# EasyEDA schematic SCH_USB-Hub-Reader_2024-05-11.json

## Sheets
1 Sheet_1: TITLE: USB HUB and Reader; REV: 1.0; Date: 2024-05-11; Sheet: 1/1; Drawn By: aaryavbehl47; Company: Your Company
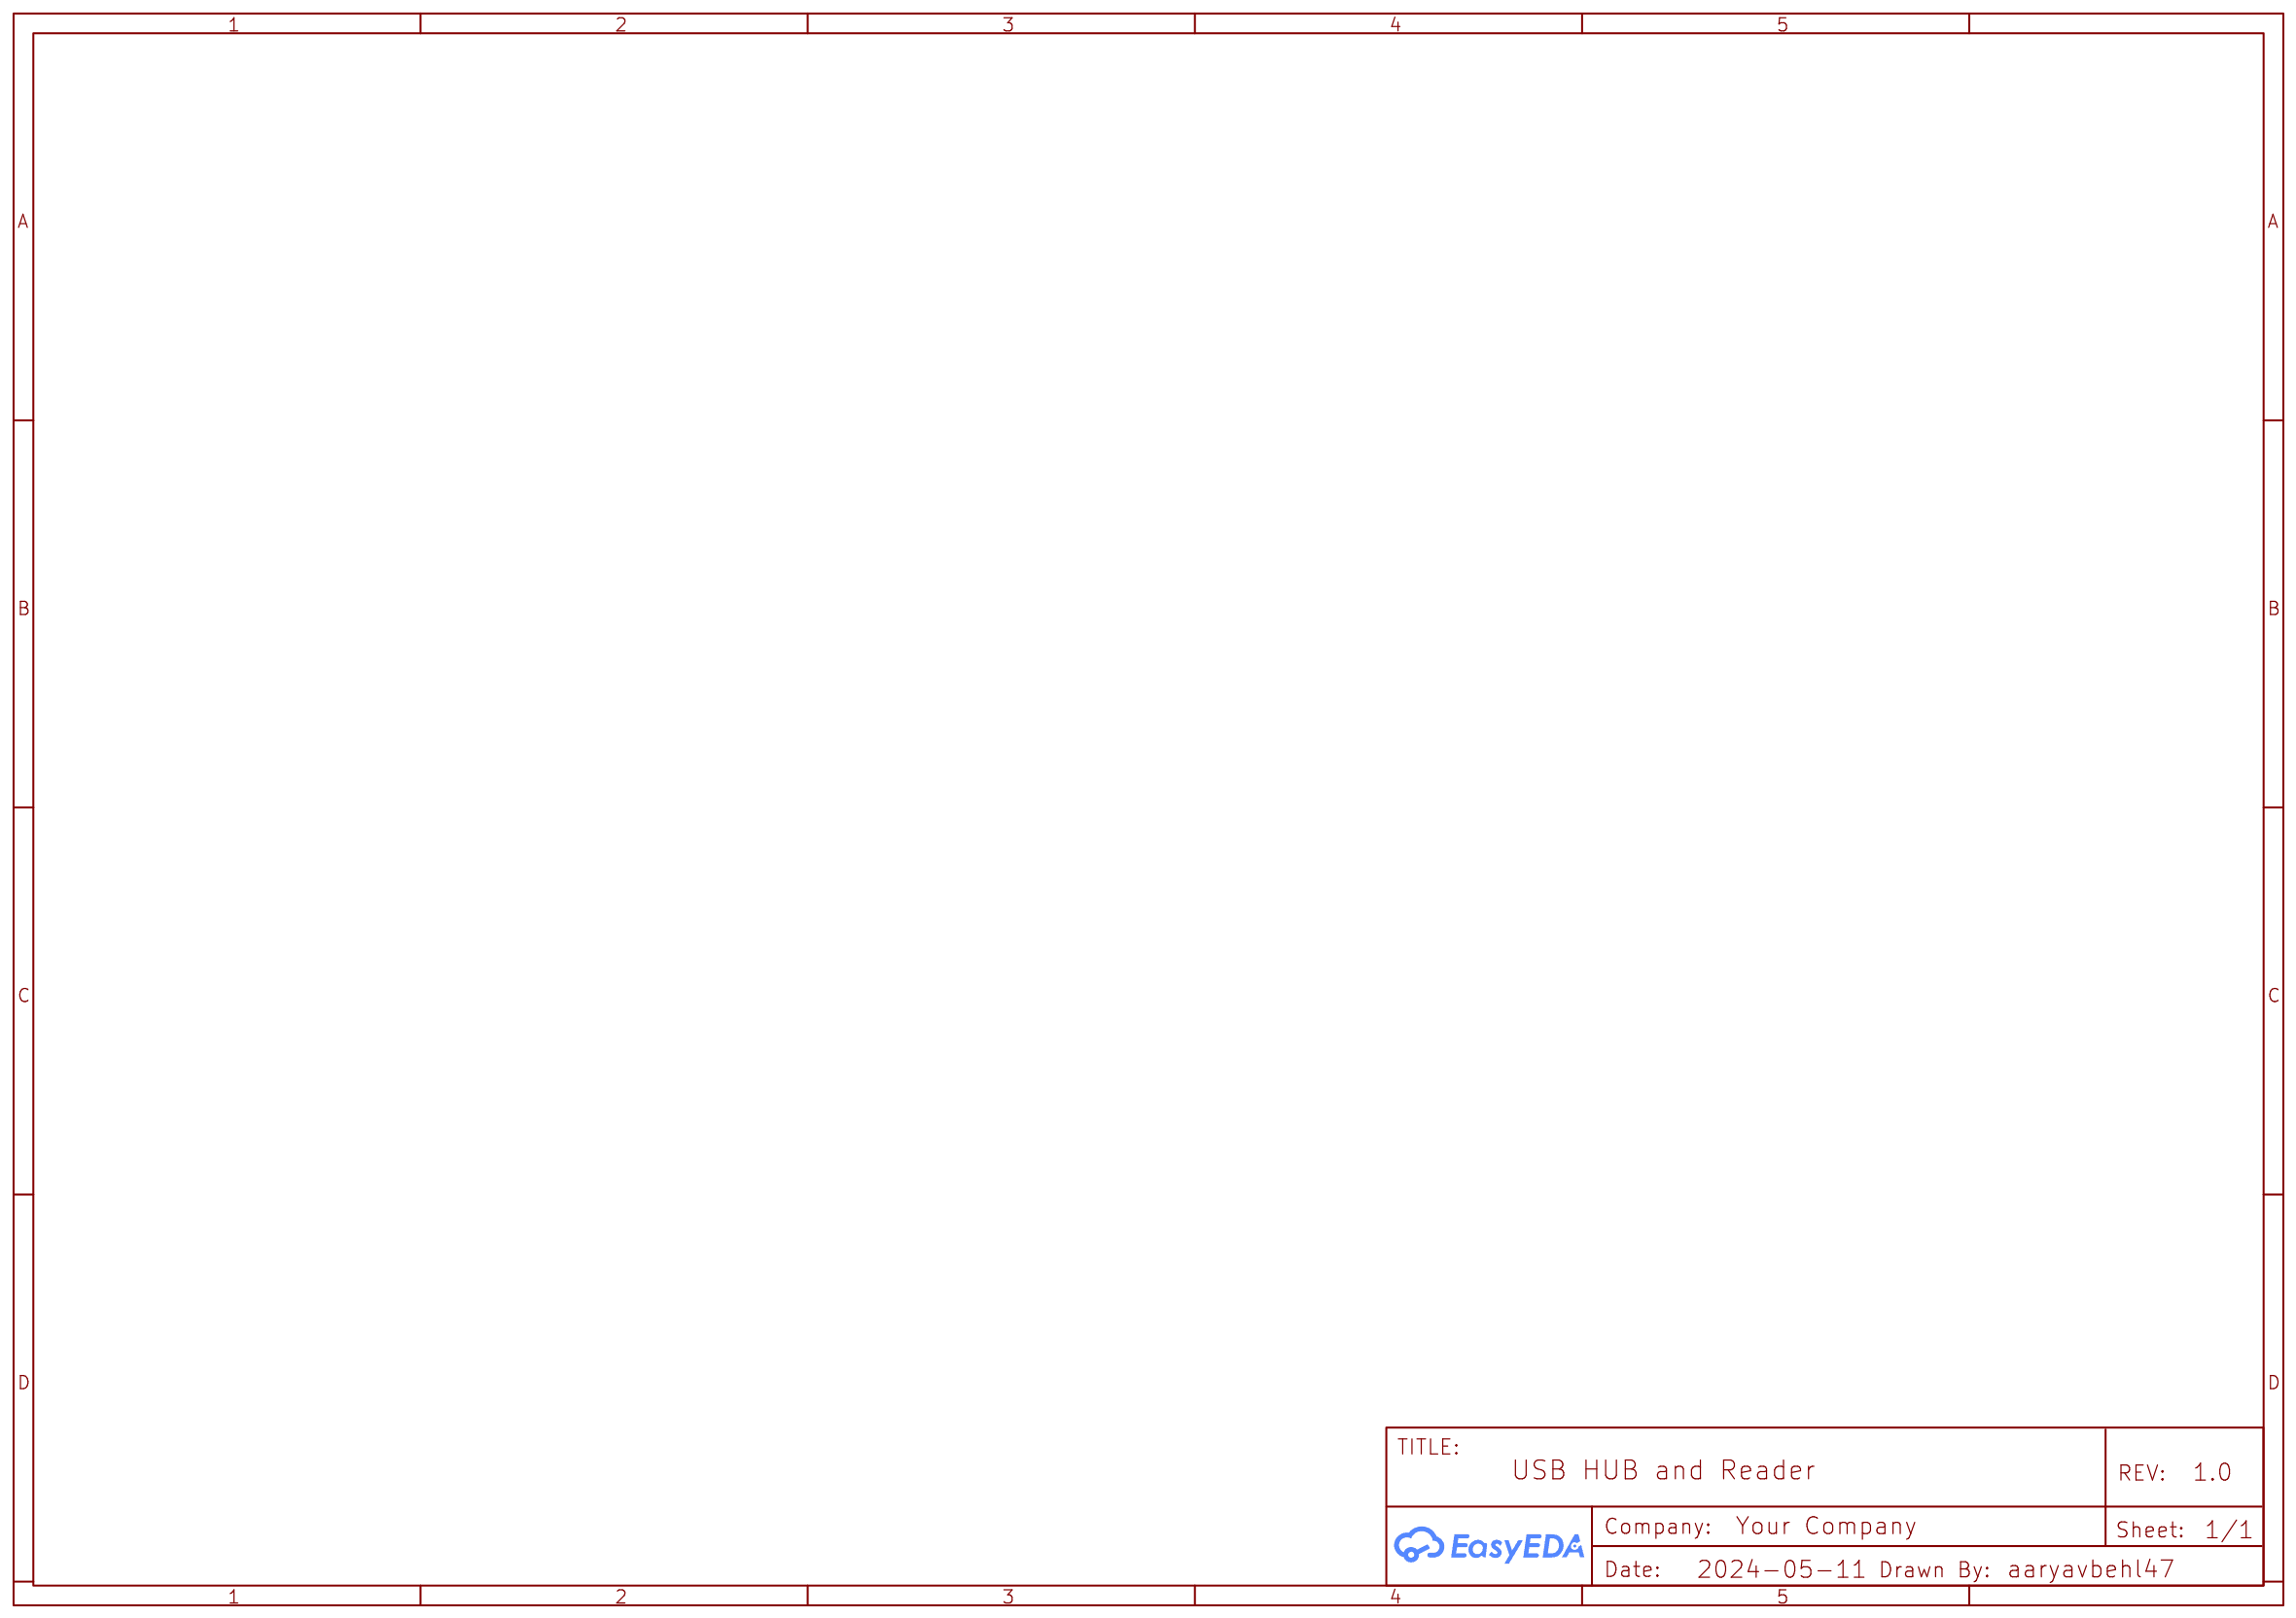
[diagram p0: Sheet_1]
2 hub schematics: TITLE: USB HUB & Reader; REV: 1; Date: 2024-04-20; Drawn By: bhargavsardana
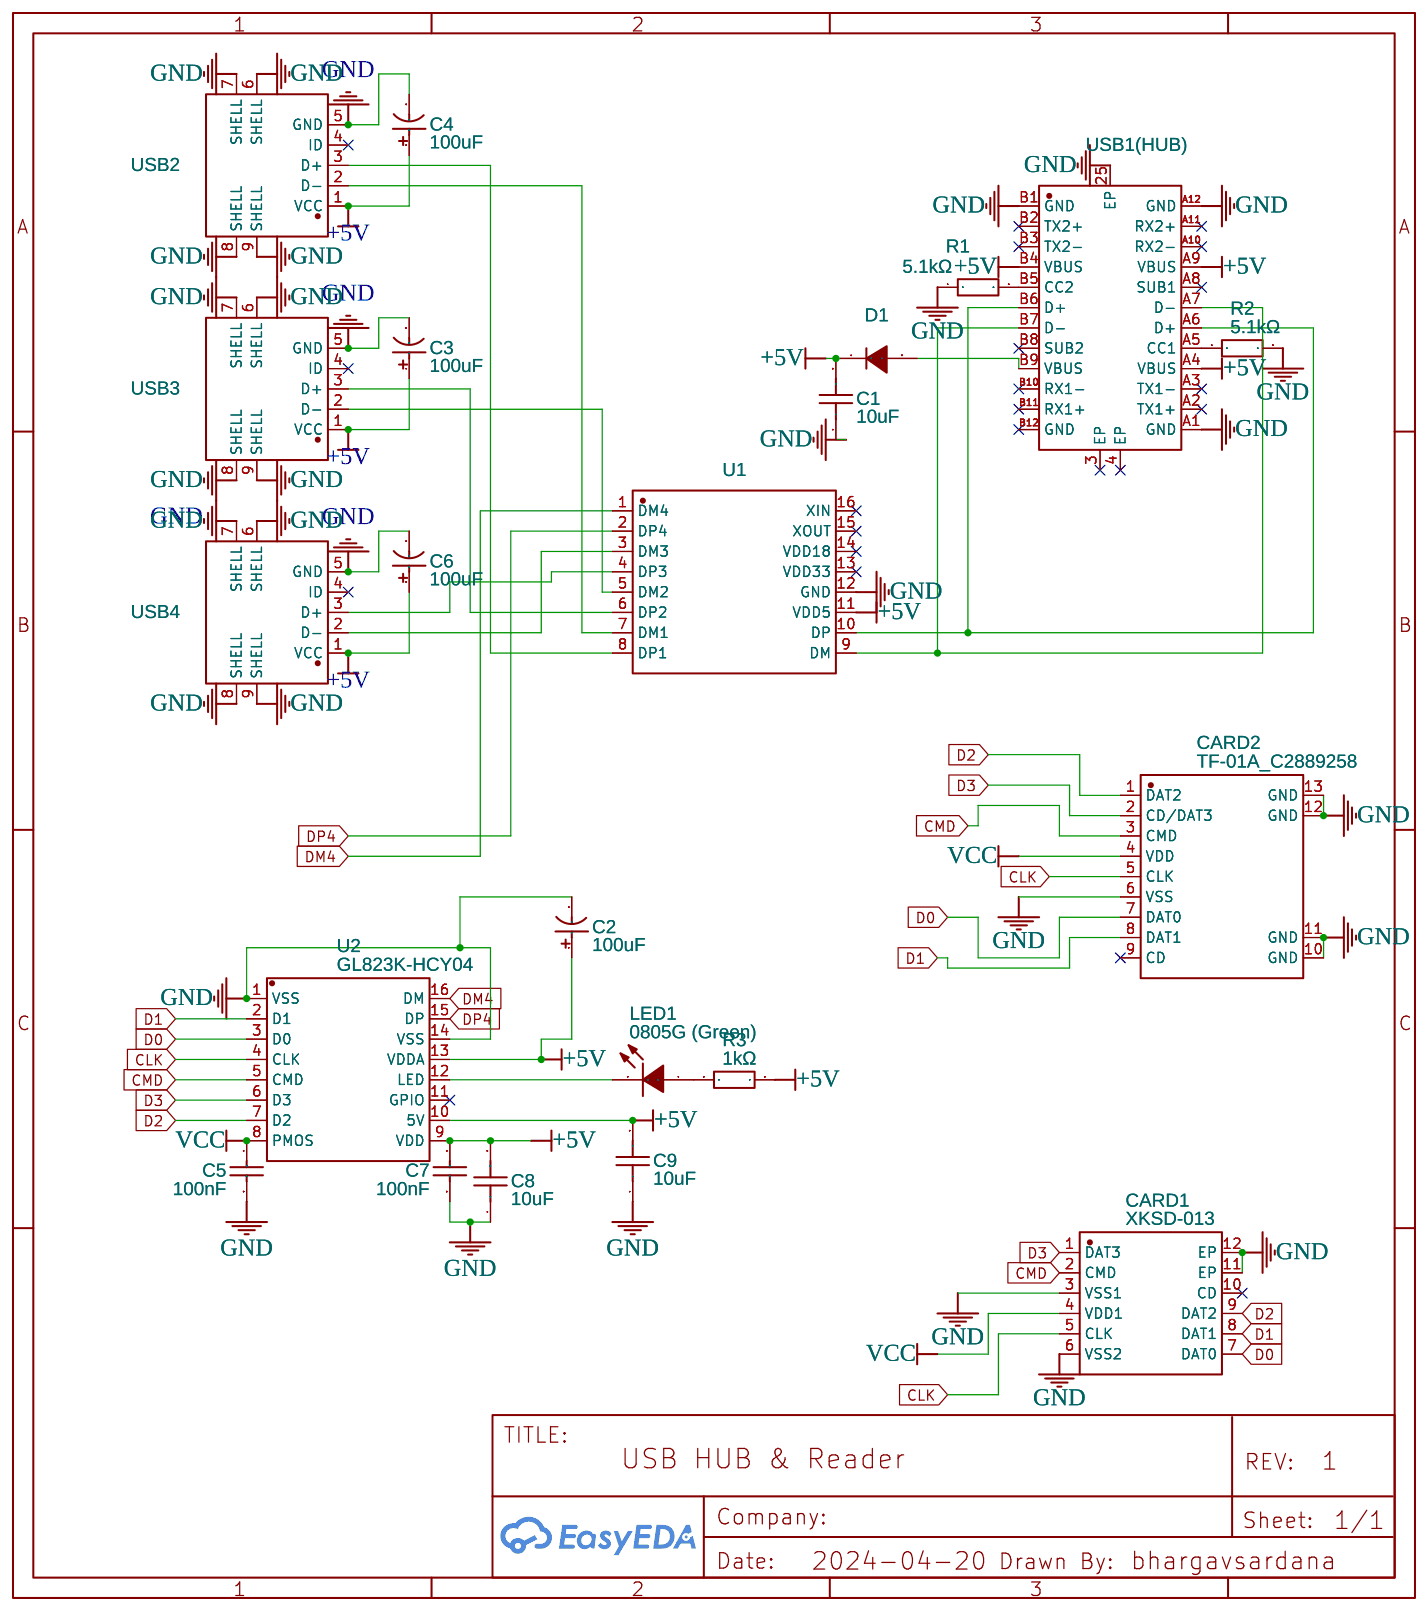
[diagram p1: hub schematics]

## Parts
C1  10uF  [C0603]
C2  100uF  [CAP-SMD_BD10.0-L10.3-W10.3-LS11.3-FD]
C3  100uF  [CAP-SMD_BD10.0-L10.3-W10.3-LS11.3-FD]
C4  100uF  [CAP-SMD_BD10.0-L10.3-W10.3-LS11.3-FD]
C5  100nF  [C0402]
C6  100uF  [CAP-SMD_BD10.0-L10.3-W10.3-LS11.3-FD]
C7  100nF  [C0402]
C8  10uF  [C0603]
C9  10uF  [C0603]
CARD1  XKSD-013  [SIM-SMD_XKSD-013]
CARD2  TF-01A_C2889258  [TF-SMD_TF-02]
D1  NSR0320MW2T1G  [SOD-323_L1.8-W1.3-LS2.5-RD]
LED1  0805G (Green)  [LED0805-R-RD]
R1  5.1kΩ  [R0402]
R2  5.1kΩ  [R0402]
R3  1kΩ  [R0402]
U1  SL2.1A  [SOP-16_L10.0-W3.9-P1.27-LS6.0-BL]
U2  GL823K-HCY04  [SSOP-16_L4.9-W3.9-P0.64-LS6.0-BL]
USB1(HUB)  TYPE-C 24P QT  [USB-C-SMD_TYPE-C-24P-QT]
USB2  U224-051N-3GRA035  [USB-A-TH_U224-051N-3GRA035]
USB3  U224-051N-3GRA035  [USB-A-TH_U224-051N-3GRA035]
USB4  U224-051N-3GRA035  [USB-A-TH_U224-051N-3GRA035]

## Library data of the parts
C1 C8 C9 = CL10A106KP8NNNC: Supplier: LCSC; Manufacturer: SAMSUNG(三星); Supplier Part: C19702; JLCPCB Part Class: Basic Part
C2-C4 C6 = RVT1J101M1010-C72481: Supplier: LCSC; Manufacturer: ROQANG(容强); Manufacturer Part: RVT1J101M1010; Supplier Part: C72481; JLCPCB Part Class: Extended Part
C5 C7 = CL05B104KO5NNNC: Supplier: LCSC; Manufacturer: SAMSUNG(三星); Supplier Part: C1525; JLCPCB Part Class: Basic Part
CARD1 = XKSD-013: Contributor: LCSC; Supplier: LCSC; Supplier Part: C2764609; Manufacturer: XKB Connectivity(中国星坤); JLCPCB Part Class: Extended Part
CARD2 = TF-01A_C2889258: Contributor: LCSC; Supplier: LCSC; Supplier Part: C2889258; Manufacturer: Yuandi(台湾元迪); Manufacturer Part: TF-01A; JLCPCB Part Class: Extended Part
D1 = NSR0320MW2T1G: Supplier: LCSC; Manufacturer: onsemi(安森美); Supplier Part: C48192; JLCPCB Part Class: Extended Part
LED1 = 0805G (Green): Supplier: LCSC; Manufacturer: KENTO; Manufacturer Part: KT-0805G; Supplier Part: C2297; JLCPCB Part Class: Basic Part
R1 R2 = 0402WGF5101TCE: Supplier: LCSC; Manufacturer: UNI-ROYAL(厚声); Supplier Part: C25905; JLCPCB Part Class: Basic Part
R3 = 0402WGF1001TCE: Supplier: LCSC; Manufacturer: UNI-ROYAL(厚声); Supplier Part: C11702; JLCPCB Part Class: Basic Part
U1 = SL2.1A: Contributor: LCSC; Supplier: LCSC; Supplier Part: C192893; Manufacturer: CoreChips(和芯润德); JLCPCB Part Class: Extended Part
U2 = GL823K-HCY04: Contributor: LCSC; Supplier: LCSC; Supplier Part: C284879; Manufacturer: GENESYS(创惟); JLCPCB Part Class: Extended Part
USB1(HUB) = TYPE-C 24P QT: Contributor: LCSC; Supplier: LCSC; Supplier Part: C2681555; Manufacturer: SHOU HAN(首韩)
USB2-USB4 = U224-051N-3GRA035: Supplier: LCSC; Supplier Part: C2689740; Manufacturer: XKB Connectivity(中国星坤); Contributor: lcsc; JLCPCB Part Class: Extended Part

## Nets
+5V: C1.2 C2.1 C3.1 C4.1 C6.1 C7.1 C8.2 C9.2 D1.1(C) R3.2 U1.11(VDD5) U2.9(VDD) U2.10(5V) U2.13(VDDA) USB1(HUB).A4(VBUS) USB1(HUB).A9(VBUS) USB1(HUB).B4(VBUS) USB2.1(VCC) USB3.1(VCC) USB4.1(VCC)
GND: C1.1 C2.2 C3.2 C4.2 C5.2 C6.2 C7.2 C8.1 C9.1 CARD1.3(VSS1) CARD1.6(VSS2) CARD1.11(EP) CARD1.12(EP) CARD2.6(VSS) CARD2.10(GND) CARD2.11(GND) CARD2.12(GND) CARD2.13(GND) R1.1 R2.2 U1.12(GND) U2.1(VSS) U2.14(VSS) USB1(HUB).25(EP) USB1(HUB).A1(GND) USB1(HUB).A12(GND) USB1(HUB).B1(GND) USB2.5(GND) USB2.6(SHELL) USB2.7(SHELL) USB2.8(SHELL) USB2.9(SHELL) USB3.5(GND) USB3.6(SHELL) USB3.7(SHELL) USB3.8(SHELL) USB3.9(SHELL) USB4.5(GND) USB4.6(SHELL) USB4.7(SHELL) USB4.8(SHELL) USB4.9(SHELL)
VCC: C5.1 CARD1.4(VDD1) CARD2.4(VDD) U2.8(PMOS)
CLK: CARD1.5(CLK) CARD2.5(CLK) U2.4(CLK)
CMD: CARD1.2(CMD) CARD2.3(CMD) U2.5(CMD)
D0: CARD1.7(DAT0) CARD2.7(DAT0) U2.3(D0)
D1: CARD1.8(DAT1) CARD2.8(DAT1) U2.2(D1)
D2: CARD1.9(DAT2) CARD2.1(DAT2) U2.7(D2)
D3: CARD1.1(DAT3) CARD2.2(CD/DAT3) U2.6(D3)
DM4: U1.1(DM4) U2.16(DM)
DP4: U1.2(DP4) U2.15(DP)
Net-(D1-2): D1.2(A) USB1(HUB).B9(VBUS)
Net-(LED1-1): LED1.1(A) R3.1
Net-(LED1-2): LED1.2(K) U2.12(LED)
Net-(R1-2): R1.2 USB1(HUB).B5(CC2)
Net-(R2-1): R2.1 USB1(HUB).A5(CC1)
Net-(U1-3): U1.3(DM3) USB4.2(D-)
Net-(U1-4): U1.4(DP3) USB4.3(D+)
Net-(U1-5): U1.5(DM2) USB3.2(D-)
Net-(U1-6): U1.6(DP2) USB3.3(D+)
Net-(U1-7): U1.7(DM1) USB2.2(D-)
Net-(U1-8): U1.8(DP1) USB2.3(D+)
Net-(U1-9): U1.9(DM) USB1(HUB).A7(D-) USB1(HUB).B7(D-)
Net-(U1-10): U1.10(DP) USB1(HUB).A6(D+) USB1(HUB).B6(D+)

Not connected (* = marked no-connect by the designer): CARD1 10(CD)*; CARD2 9(CD)*; U1 13(VDD33)* 14(VDD18)* 15(XOUT)* 16(XIN)*; U2 11(GPIO)*; USB1(HUB) 3(EP)* 4(EP)* A2(TX1+)* A3(TX1-)* A8(SUB1)* A10(RX2-)* A11(RX2+)* B2(TX2+)* B3(TX2-)* B8(SUB2)* B10(RX1-)* B11(RX1+)* B12(GND)*; USB2 4(ID)*; USB3 4(ID)*; USB4 4(ID)*

## Notes on the sheets
sheet 2
- GND
